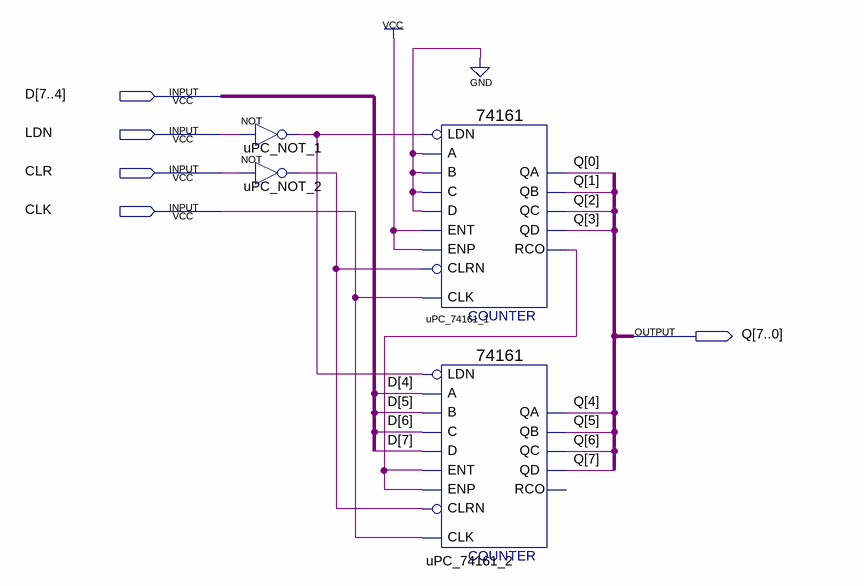
[diagram p0: schematic sheet]
// Quartus schematic uPC.bdf as structural Verilog: 4 symbols, 5 pins
module uPC (
  input  [7:4] D,
  input  LDN,
  input  CLR,
  input  CLK,
  output [7:0] Q
);

  wire uPC_74161_1_rco, uPC_NOT_1_out, uPC_NOT_2_out;

  not uPC_NOT_1 (uPC_NOT_1_out, LDN);
  not uPC_NOT_2 (uPC_NOT_2_out, CLR);
  \74161  uPC_74161_1 (
    .CLRN(uPC_NOT_2_out), .CLK(CLK), .ENP(1'b1), .LDN(uPC_NOT_1_out), .A(1'b0), .D(1'b0), .ENT(1'b1),
    .B(1'b0), .C(1'b0), .QD(Q[3]), .QC(Q[2]), .QB(Q[1]), .QA(Q[0]), .RCO(uPC_74161_1_rco));
  \74161  uPC_74161_2 (
    .CLRN(uPC_NOT_2_out), .CLK(CLK), .ENP(uPC_74161_1_rco), .LDN(uPC_NOT_1_out), .A(D[4]), .D(D[7]),
    .ENT(uPC_74161_1_rco), .B(D[5]), .C(D[6]), .QD(Q[7]), .QC(Q[6]), .QB(Q[5]), .QA(Q[4]));  // open: RCO
endmodule
